# Altium schematic sheet Schematic DRAFT.schdoc
size 182 x 116 mm
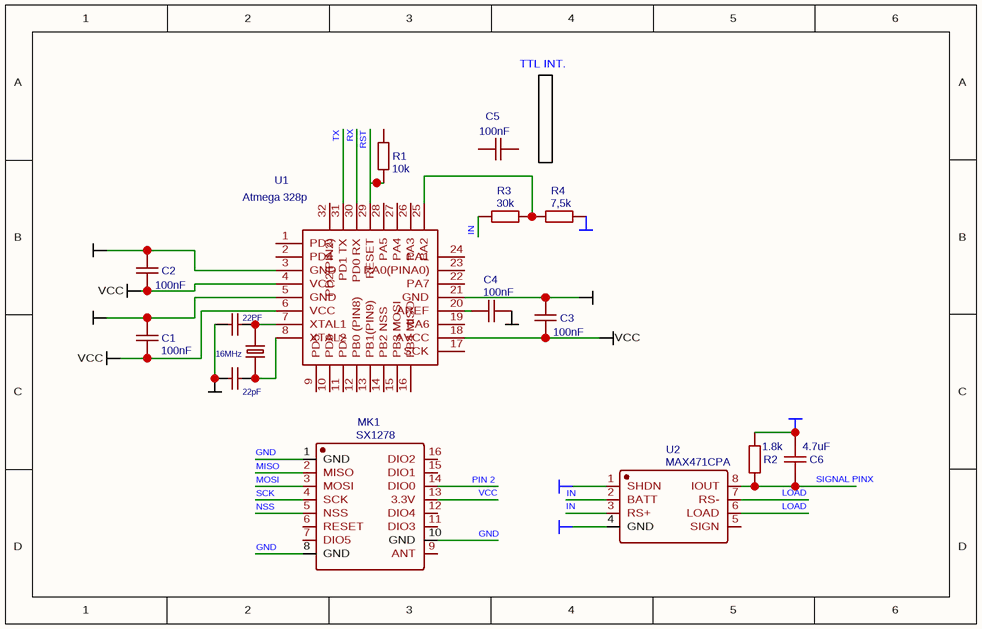
[diagram p0: Schematic DRAFT.schdoc]

## Parts
22PF  100nF  [CAP-3.5*7.5*7.2]  (value not drawn)
C1  100nF  [CAP-3.5*7.5*7.2]
C2  100nF  [CAP-3.5*7.5*7.2]
C3  100nF  [CAP-3.5*7.5*7.2]
C4  100nF  [CAP-3.5*7.5*7.2]
C5  100nF  [CAP-3.5*7.5*7.2]
C6  4.7uF  [RAD-0.1]
C7  22pF  [CAP-3.5*7.5*7.2]
MK1  SX1278  [SX1278]
R1  10k  [AXIAL-0.3]
R2  1.8k  [AXIAL-0.3]
R3  30k  [AXIAL-0.3]
R4  7,5k  [AXIAL-0.3]
U1  Atmega 328p  [TQFP-32]
U2  MAX471CPA  [DIP8]
X1  16MHz  [HC-49SMD]

## Nets
GND: 22PF.1 C1.2 C2.2 C3.2 C4.2 C6.2 C7.1 R2.2 R4.2 U1.3(GND) U1.5(GND) U1.21(GND) U2.1(SHDN) U2.4(GND)
VCC: C1.1 C2.1 C3.1 U1.4(VCC) U1.6(VCC) U1.18(AVCC)
Net22PF_2: 22PF.2 U1.7(XTAL1) X1.2
NetC4_1: C4.1 U1.20(AREF)
NetC6_1: C6.1 R2.1 U2.8(IOUT)
NetC7_2: C7.2 U1.8(XTAL2) X1.1
NetR1_2: R1.2 U1.29(RESET)
NetR3_2: R3.2 R4.1 U1.25(PA2)

Not connected (* = marked no-connect by the designer): C5 1 2; MK1 1(GND) 2(MISO) 3(MOSI) 4(SCK) 5(NSS) 6(RESET) 7(DIO5) 8(GND) 9(ANT) 10(GND) 11(DIO3) 12(DIO4) 13(3.3V) 14(DIO0) 15(DIO1) 16(DIO2); R1 1; R3 1; U1 1(PD3) 2(PD4) 9(PD5) 10(PD6) 11(PD7) 12(PB0_(PIN8)) 13(PB1(PIN9)) 14(PB2_NSS) 15(PB3_MOSI) 16(PB4_MISO) 17(SCK) 19(PA6) 22(PA7) 23(PA0(PINA0)) 24(PA1) 26(PA3) 27(PA4) 28(PA5) 30(PD0_RX) 31(PD1_TX) 32(PD2(PIN2)); U2 2(BATT) 3(RS+) 5(SIGN) 6(LOAD) 7(RS-)

## Notes on the sheet
- TTL INT.
- (near R1) TX
- (near R1) RX
- (near R1) RST
- (near R3) IN
- GND
- (near MK1) MOSI
- (near MK1) MISO
- (near MK1) SCK
- (near MK1) NSS
- (near MK1) PIN 2
- VCC
- (near U2) IN
- (near C6) LOAD
- LOAD
- (near C6) SIGNAL PINX
- (near MK1) GND

## Library data of the parts
22PF C1-C5 C7 = (no symbol name): BOM_Manufacturer: ReliaPro; BOM_Manufacturer Part: Calibration capacitor100nF（104）100V,5%; nameAlias: Value; Contributor: LCSC; BOM_Supplier: LCSC; BOM_LCSC: C26609; spicePre: C; spiceSymbolName: Calibration capacitor100nF（104）100V,5%
C6 = (no symbol name): nameAlias: Value(F); BOM_Manufacturer Part: ?; spicePre: C; spiceSymbolName: Cap_RAD-0.1_US
MK1 = (no symbol name): BOM_Manufacturer: LCX; Contributor: LCSC; BOM_Supplier: LCSC; BOM_Manufacturer Part: SX1278; BOM_LCSC: C87473; spicePre: M
R1-R4 = (no symbol name): nameAlias: Value(Ω); BOM_Manufacturer Part: ?; spicePre: R; spiceSymbolName: Res_AXIAL-0.3(1/8W)_EU
U1 = (no symbol name): BOM_Manufacturer Part: Atmega 328p smd; Contributor: rienkvandenberg; BOM_Mounted: Yes; BOM_Supplier: EasyEDA; spicePre: U
X1 = (no symbol name): BOM_Manufacturer: TAE; BOM_Manufacturer Part: HC-49SM16MHz20pF30ppm; nameAlias: Frequency; Contributor: LCSC; BOM_Supplier: LCSC; BOM_LCSC: C111377; spicePre: X; spiceSymbolName: HC-49SM16MHz20pF30ppm
U2 = (no symbol name): spicePre: X; BOM_Manufacturer Part: ?